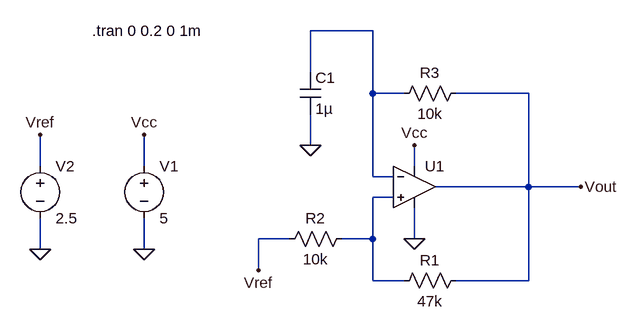
[diagram p0: schematic schmit_trigger_oscillator.asc]
schmit_trigger_oscillator.asc, the LTspice schematic file:
Version 4.1
SHEET 1 880 680
WIRE 176 -80 80 -80
WIRE 80 -16 80 -80
WIRE 176 16 176 -80
WIRE 224 16 176 16
WIRE 416 16 304 16
WIRE 80 96 80 48
WIRE -336 128 -336 80
WIRE -176 128 -176 80
WIRE 240 128 240 96
WIRE 176 144 176 16
WIRE 208 144 176 144
WIRE 416 160 416 16
WIRE 416 160 272 160
WIRE 496 160 416 160
WIRE 208 176 176 176
WIRE 48 240 0 240
WIRE 176 240 176 176
WIRE 176 240 128 240
WIRE 240 240 240 192
WIRE -336 256 -336 208
WIRE -176 256 -176 208
WIRE 0 288 0 240
WIRE 176 304 176 240
WIRE 224 304 176 304
WIRE 416 304 416 160
WIRE 416 304 304 304
FLAG -176 256 0
FLAG -336 256 0
FLAG -176 80 Vcc
FLAG -336 80 Vref
FLAG 240 240 0
FLAG 240 96 Vcc
FLAG 80 96 0
FLAG 496 160 Vout
FLAG 0 288 Vref
SYMBOL OpAmps\\UniversalOpAmp2 240 160 R0
SYMATTR InstName U1
SYMBOL voltage -176 112 R0
WINDOW 123 0 0 Left 0
WINDOW 39 0 0 Left 0
SYMATTR InstName V1
SYMATTR Value 5
SYMBOL voltage -336 112 R0
WINDOW 123 0 0 Left 0
WINDOW 39 0 0 Left 0
SYMATTR InstName V2
SYMATTR Value 2.5
SYMBOL res 320 288 R90
WINDOW 0 0 56 VBottom 2
WINDOW 3 32 56 VTop 2
SYMATTR InstName R1
SYMATTR Value 47k
SYMBOL res 144 224 R90
WINDOW 0 0 56 VBottom 2
WINDOW 3 32 56 VTop 2
SYMATTR InstName R2
SYMATTR Value 10k
SYMBOL cap 64 -16 R0
SYMATTR InstName C1
SYMATTR Value 1µ
SYMBOL res 320 0 R90
WINDOW 0 0 56 VBottom 2
WINDOW 3 32 56 VTop 2
SYMATTR InstName R3
SYMATTR Value 10k
TEXT -256 -80 Left 2 !.tran 0 0.2 0 1m

The netlist it stands for:
* schmit_trigger_oscillator.asc
X§U1 N002 N001 Vcc 0 Vout level2 Avol=1Meg GBW=10Meg Slew=10Meg Ilimit=25m Rail=0 Vos=0 En=0 Enk=0 In=0 Ink=0 Rin=500Meg  ; pins In+ In- V+ V- OUT
V1 Vcc 0 5
V2 Vref 0 2.5
R1 Vout N002 47k
R2 N002 Vref 10k
C1 N001 0 1µ
R3 Vout N001 10k
.tran 0 0.2 0 1m
.lib UniversalOpAmp2.lib
.backanno
.end